# EAGLE design Glucose_Meter_Rev2 (EAGLE 7.6.0)
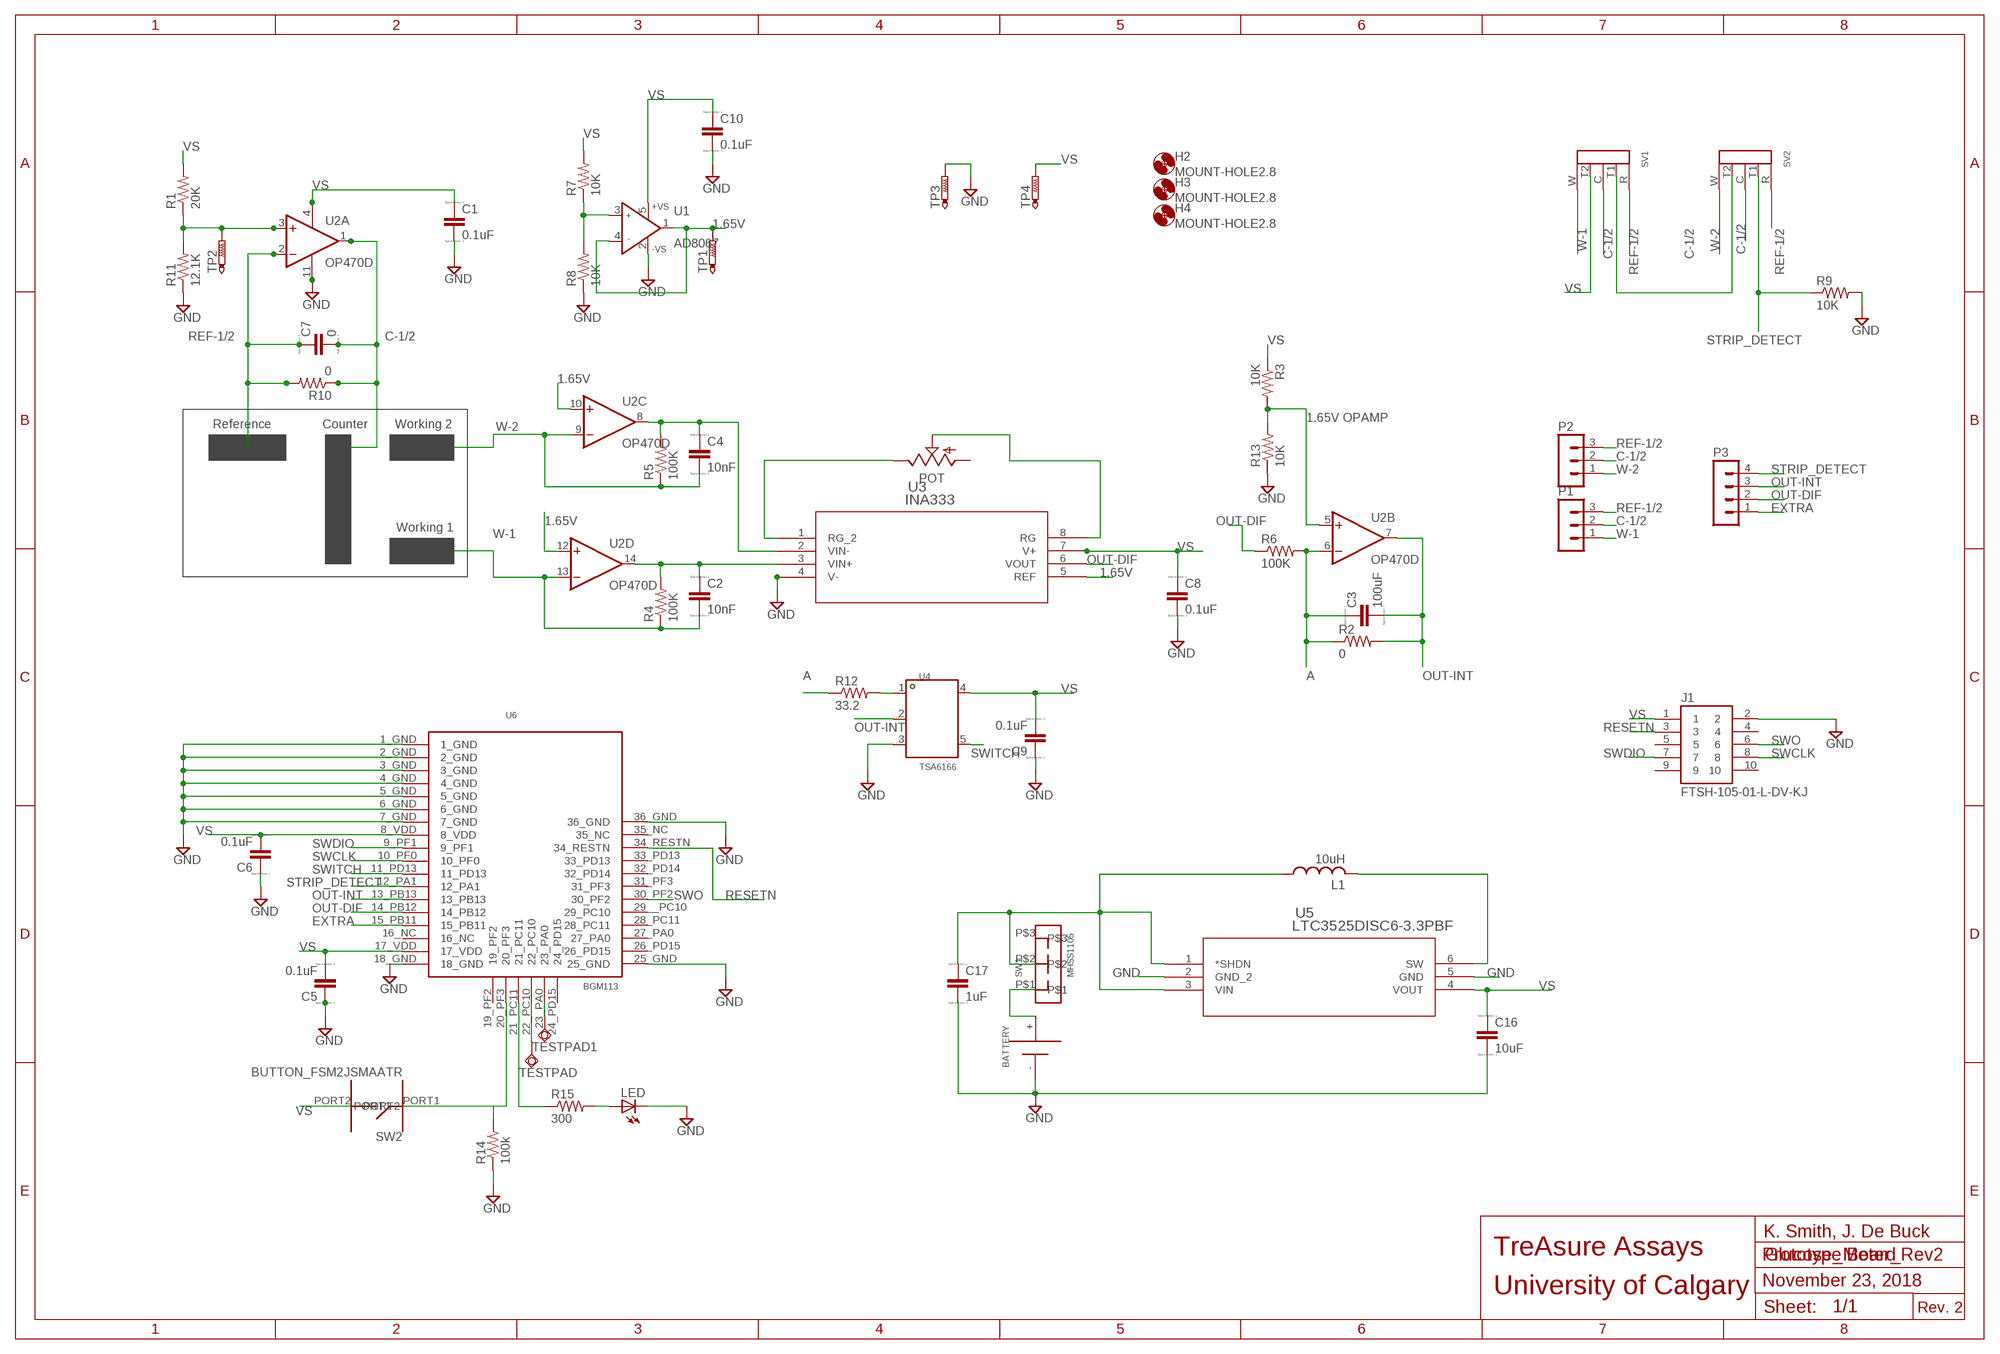
[diagram p0: schematic, sheet 1]

## Parts
BATTERY  SMTU2032  [SMTU2032]
C1  0.1uF  C  [C0805]
C2  10nF  C  [C0805]
C3  100uF  CC1210  [C1210]
C4  10nF  C  [C0805]
C5  0.1uF  C  [C0805]
C6  0.1uF  C  [C0805]
C7  0  C  [C0805]
C8  0.1uF  C  [C0805]
C9  0.1uF  C  [C0805]
C10  0.1uF  C  [C0805]
C16  10uF  C  [C0805]
C17  1uF  C  [C0805]
H2  MOUNT-HOLE2.8  [2,8]
H3  MOUNT-HOLE2.8  [2,8]
H4  MOUNT-HOLE2.8  [2,8]
J1  FTSH-105-01-L-DV-KJ  [SAMTEC_FTSH-105-01-L-DV-K]
L1  10uH  L-USL3225M  [L3225M]
LED  LED3MM  [LED3MM]
P1  MA03-1  [MA03-1]
P2  MA03-1  [MA03-1]
P3  MA04-1  [MA04-1]
POT  TRIM_US-RJ9W  [RJ9W]
R1  20K  R-US_R0805  [R0805]
R2  0  R-US_R0805  [R0805]
R3  10K  R-US_R0805  [R0805]
R4  100K  R-US_R0805  [R0805]
R5  100K  R-US_R0805  [R0805]
R6  100K  R-US_R0805  [R0805]
R7  10K  R-US_R0805  [R0805]
R8  10K  R-US_R0805  [R0805]
R9  10K  R-US_R0805  [R0805]
R10  0  R-US_R0805  [R0805]
R11  12.1K  R-US_R0805  [R0805]
R12  33.2  R-US_R0805  [R0805]
R13  10K  R-US_R0805  [R0805]
R14  100k  R-US_R0805  [R0805]
R15  300  R-US_R0805  [R0805]
SV1  SW-JS-05  [SW-JS-05]
SV2  SW-JS-05  [SW-JS-05]
SW1  MHSS1105  [MHSS1105]
SW2  BUTTON_FSM2JSMAATR  [BUTTON_FSM2JSMAATR]
TESTPAD  TPSQTP06R  [TP06R]
TESTPAD1  TPSQTP06R  [TP06R]
TP1  PTR1PAD1-13  [P1-13]
TP2  PTR1PAD1-13  [P1-13]
TP3  PTR1PAD1-13  [P1-13]
TP4  PTR1PAD1-13  [P1-13]
U1  AD8067  [SOT23-5]
U2  OP470D  [SO14]
U3  INA333  INA333_DGK_8  [DGK8]
U4  TSA6166  [SOT23-5]
U5  LTC3525DISC6-3.3PBF  [SC70-SC6]
U6  BGM113  [BGM113]

## Nets
1.65V: TP1.TP U1.1(OUT) U1.4(IN-) U2.10(C:+IN) U2.12(D:+IN) U3.5(REF)
3V_BATTERY1: C17.1 L1.1 SW1.P$2 U5.1(*SHDN) U5.3(VIN)
A: C3.1 R2.1 R6.2 R12.1 U2.6(B:-IN)
C-1/2: C7.2 P1.2 P2.2 R10.1 SV1.C SV2.C U2.1(A:OUT)
EXTRA: P3.1 U6.15_PB11
GND: BATTERY.- C1.2 C5.1 C6.1 C8.2 C9.1 C10.2 C16.2 C17.2 J1.2 LED.K(C) R8.1 R9.2 R11.1 R13.1 R14.1 TP3.TP U1.2(-VS) U2.11(P:V-) U3.4(V-) U4.3(GND) U5.2(GND_2) U5.5(GND) U6.1_GND U6.2_GND U6.3_GND U6.4_GND U6.5_GND U6.6_GND U6.7_GND U6.18_GND U6.25_GND U6.36_GND
N$1: R12.2 U4.1(A)
N$2: R1.1 R11.2 TP2.TP U2.3(A:+IN)
N$3: BATTERY.+ SW1.P$1
N$4: L1.2 U5.6(SW)
N$5: C4.1 R5.2 U2.8(C:OUT) U3.2(VIN-)
N$6: R14.2 SW2.PORT1 U6.20_PF3
N$7: POT.E U3.1(RG_2)
N$8: POT.S U3.8(RG)
N$9: LED.A R15.2
N$10: R15.1 U6.21_PC11
N$12: R7.1 R8.2 U1.3(IN+)
N$15: SV1.T1 SV2.T2
N$17: R3.2 R13.2 U2.5(B:+IN)
N$18: C2.1 R4.2 U2.14(D:OUT) U3.3(VIN+)
N$21: TESTPAD.TP U6.22_PC10
N$22: TESTPAD1.TP U6.23_PA0
OUT-DIF: P3.2 R6.1 U3.6(VOUT) U6.14_PB12
OUT-INT: C3.2 P3.3 R2.2 U2.7(B:OUT) U4.2(B) U6.13_PB13
REF-1/2: C7.1 P1.3 P2.3 R10.2 SV1.R SV2.R U2.2(A:-IN)
RESETN: J1.3 U6.34_RESTN
STRIP_DETECT: P3.4 R9.1 SV2.T1 U6.12_PA1
SWCLK: J1.8 U6.10_PF0
SWDIO: J1.7 U6.9_PF1
SWITCH: U4.5(ON/OFF) U6.11_PD13
SWO: J1.6 U6.30_PF2
VS: C1.1 C5.2 C6.2 C8.1 C9.2 C10.1 C16.1 J1.1 R1.2 R3.1 R7.2 SV1.T2 SW2.PORT2 TP4.TP U1.5(+VS) U2.4(P:V+) U3.7(V+) U4.4(VS) U5.4(VOUT) U6.8_VDD U6.17_VDD
W-1: C2.2 P1.1 R4.1 SV1.W U2.13(D:-IN)
W-2: C4.2 P2.1 R5.1 SV2.W U2.9(C:-IN)
Unconnected: J1.4 J1.5 J1.9 J1.10 POT.A SW1.P$3 U6.16_NC U6.19_PF2 U6.24_PD15 U6.26_PD15 U6.27_PA0 U6.28_PC11 U6.29__PC10(29_PC10) U6.31_PF3 U6.32_PD14 U6.33_PD13 U6.35_NC

## Notes on the sheet
- 1.65V OPAMP
- Reference | Counter | Working 2
- Working 1
- K. Smith, J. De Buck
- TreAsure Assays | Prototype Board
- November 23, 2018
- University of Calgary
- Rev. 2

## Library data of the parts
BATTERY = Katrin's Footprint:SMTU2032: Renata SMTU2032. Coin Cell Battery Holders SFC MNT FOR CR2032
C1-C10 C16 C17 = eagle-ltspice:C: CAPACITOR, European symbol; SPICEMODEL: NONE; SPICEPREFIX: C
H2-H4 = holes:MOUNT-HOLE: MOUNTING HOLE with drill center marker
J1 = FTSH-105-01-L-DV-K:FTSH-105-01-L-DV-K: Conn Unshrouded Header HDR 10 POS 1.27mm Solder ST SMD Automotive Tube; AVAILABILITY: Unavailable; DESCRIPTION: Conn Unshrouded Header HDR 10 POS 1.27mm Solder ST SMD Automotive Tube; MF: Samtec Inc.; MP: FTSH-105-01-L-DV-K; PACKAGE: TSSOP-20 Texas Instruments; PRICE: None
L1 = rcl:L-US: INDUCTOR, American symbol
LED = led:LED: LED OSRAM: - CHIPLED LG R971, LG N971, LY N971, LG Q971, LY Q971, LO R971, LY R971 LH N974, LH R974 LS Q976, LO Q976, LY Q976 LO Q996 - Hyper CHIPLED LW Q18S LB Q993, LB Q99A, LB R99A - SideLED LS A670, LO A670, LY A670, LG A670, LP A670 LB A673, LV A673, LT A673, LW A673 LH A674 LY A675 LS A676, LA A676, LO A676, LY A676, LW A676 LS A679, LY A679, LG A679 - Hyper Micro SIDELED® LS Y876, LA Y876, LO Y876, LY Y876 LT Y87S - SmartLED LW L88C, LW L88S LB L89C, LB L89S, LG L890 LS L89K, LO L89K, LY L89K LS L896, LA L896, LO L896, LY L896 - TOPLED LS T670, LO T670, LY T670, LG T670, LP T670 LSG T670, LSP T670, LSY T670, LOP T670, LYG T670 LG T671, LOG T671, LSG T671 LB T673, LV T673, LT T673, LW T673 LH T674 LS T676, LA T676, LO T676, LY T676, LB T676, LH T676, LSB T676, LW T676 LB T67C, LV T67C, LT T67C, LS T67K, LO T67K, LY T67K, LW E67C LS E67B, LA E67B, LO E67B, LY E67B, LB E67C, LV E67C, LT E67C LW T67C LS T679, LY T679, LG T679 LS T770, LO T770, LY T770, LG T770, LP T770 LB T773, LV T773, LT T773, LW T773 LH T774 LS E675, LA E675, LY E675, LS T675 LS T776, LA T776, LO T776, LY T776, LB T776 LHGB T686 LT T68C, LB T68C - Hyper Mini TOPLED® LB M676 - Mini TOPLED Santana® LG M470 LS M47K, LO M47K, LY M47K Source: http://www.osram.convergy.de LUXEON: - LUMILED® LXK2-PW12-R00, LXK2-PW12-S00, LXK2-PW14-U00, LXK2-PW14-V00 LXK2-PM12-R00, LXK2-PM12-S00, LXK2-PM14-U00 LXK2-PE12-Q00, LXK2-PE12-R00, LXK2-PE12-S00, LXK2-PE14-T00, LXK2-PE14-U00 LXK2-PB12-K00, LXK2-PB12-L00, LXK2-PB12-M00, LXK2-PB14-N00, LXK2-PB14-P00, LXK2-PB14-Q00 LXK2-PR12-L00, LXK2-PR12-M00, LXK2-PR14-Q00, LXK2-PR14-R00 LXK2-PD12-Q00, LXK2-PD12-R00, LXK2-PD12-S00 LXK2-PH12-R00, LXK2-PH12-S00 LXK2-PL12-P00, LXK2-PL12-Q00, LXK2-PL12-R00 Source: www.luxeon.com KINGBRIGHT: KA-3528ASYC Source: www.kingbright.com
P1 P2 = con-lstb:MA03-1: PIN HEADER; OC_FARNELL: unknown; OC_NEWARK: unknown
P3 = con-lstb:MA04-1: PIN HEADER; OC_FARNELL: unknown; OC_NEWARK: unknown
POT = pot:TRIM_US-: POTENTIOMETER
R1-R15 = resistor:R-US_: RESISTOR, American symbol
SV1 SV2 = Katrin's Footprint:SW-JS-05: Footprint for SW-JS-05 connector for ONE TOUCH ULTRA glucose test strips
SW1 = Katrin's Footprint:MHSS1105
SW2 = Katrin's Footprint:BUTTON_FSM2JSMAATR
TESTPAD TESTPAD1 = testpad:TPSQ: Test pad
TP1-TP4 = testpad:PTR1: TEST PIN
U1 = analog-devices:AD8067: High Gain Bandwidth, Precision Fast FET(TM) Op Amp Source: http://www.analog.com/UploadedFiles/Data_Sheets/346131962AD8067_a.pdf; MF: ALTERA CORPORATION; MPN: AD8067ARTZ-REEL7; OC_FARNELL: 1464848; OC_NEWARK: 59K6326
U2 = linear:OP470: OP AMP
U3 = INA333:INA333_DGK_8; DATASHEETURL: http://www.ti.com/lit/gpn/INA333; FAMILY_NAME: SINGLE SUPPLY; GENERIC_PART_NUMBER: INA333; INDUSTRY_STD_PKG_TYPE: MSOP; MANUFACTURER: Texas Instruments; MANUFACTURER_PART_NUMBER: ina333_dgk_8; PACKAGE_DESIGNATOR: DGK; PIN_COUNT: 8; VENDOR: Texas Instruments
U4 = Katrin's Footprint:TSA6166
U5 = LTC3525D-3.3:LTC3525DISC6-3.3PBF; MANUFACTURER_PART_NUMBER: ltc3525disc6-3.3#pbf; VENDOR: Linear Technology
U6 = Katrin's Footprint:BGM113

## Board
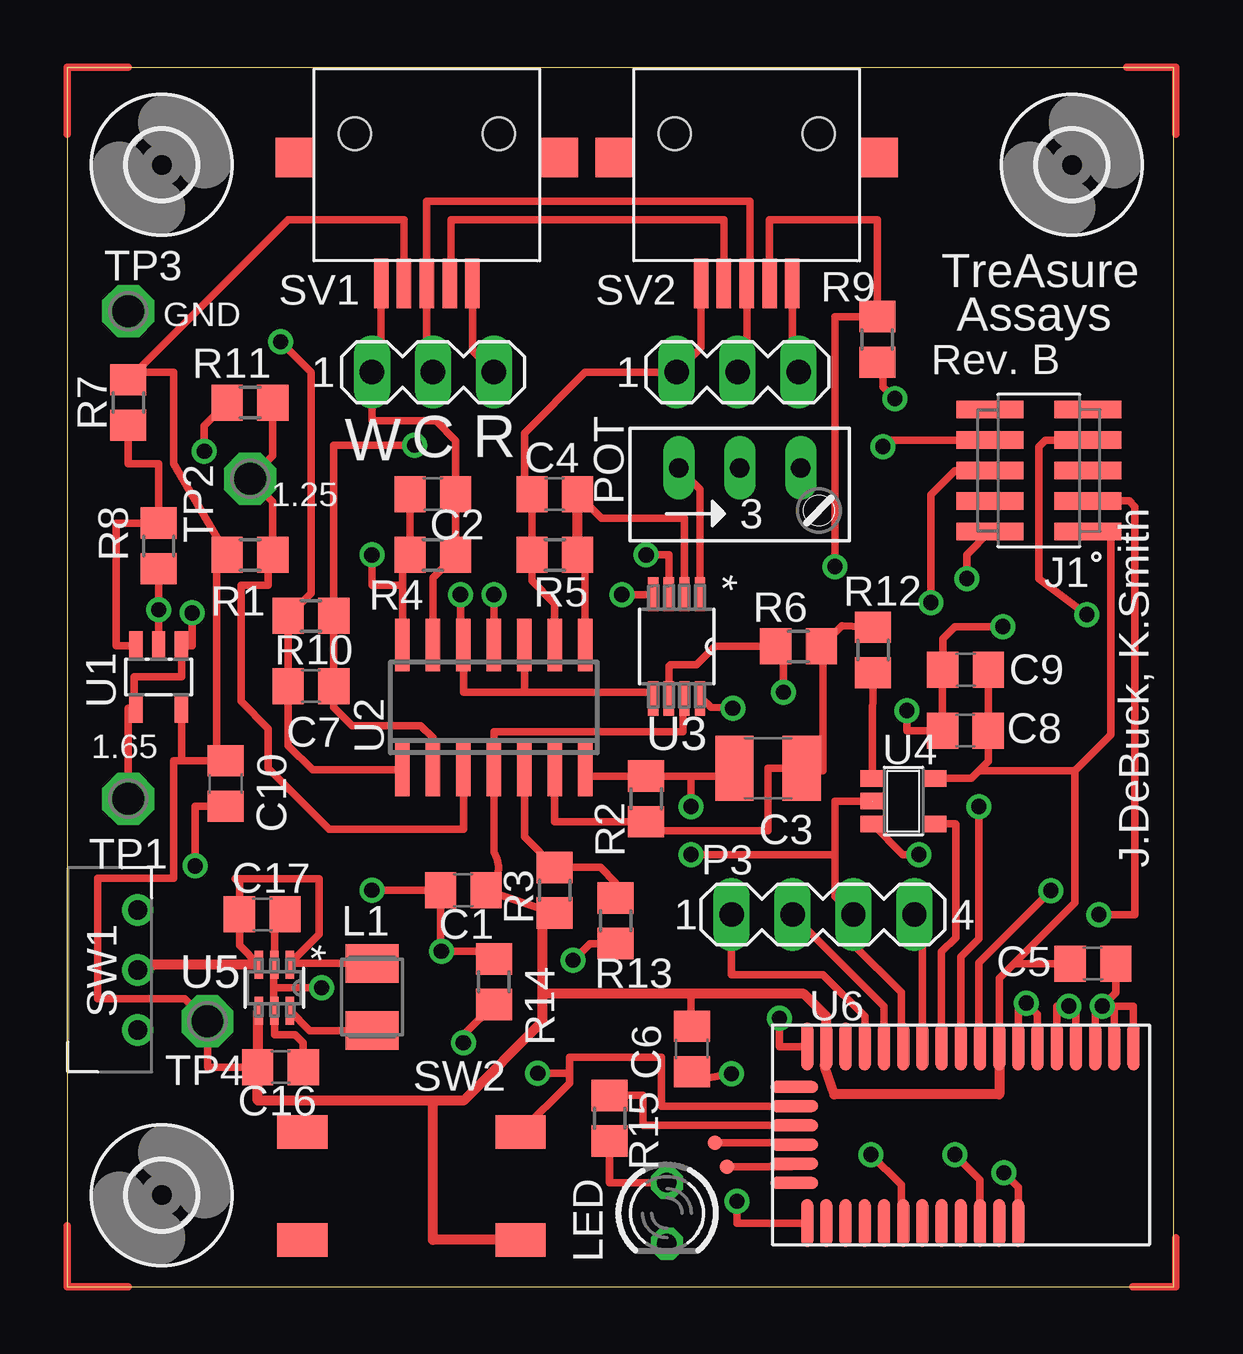
[diagram p1: board, top side]
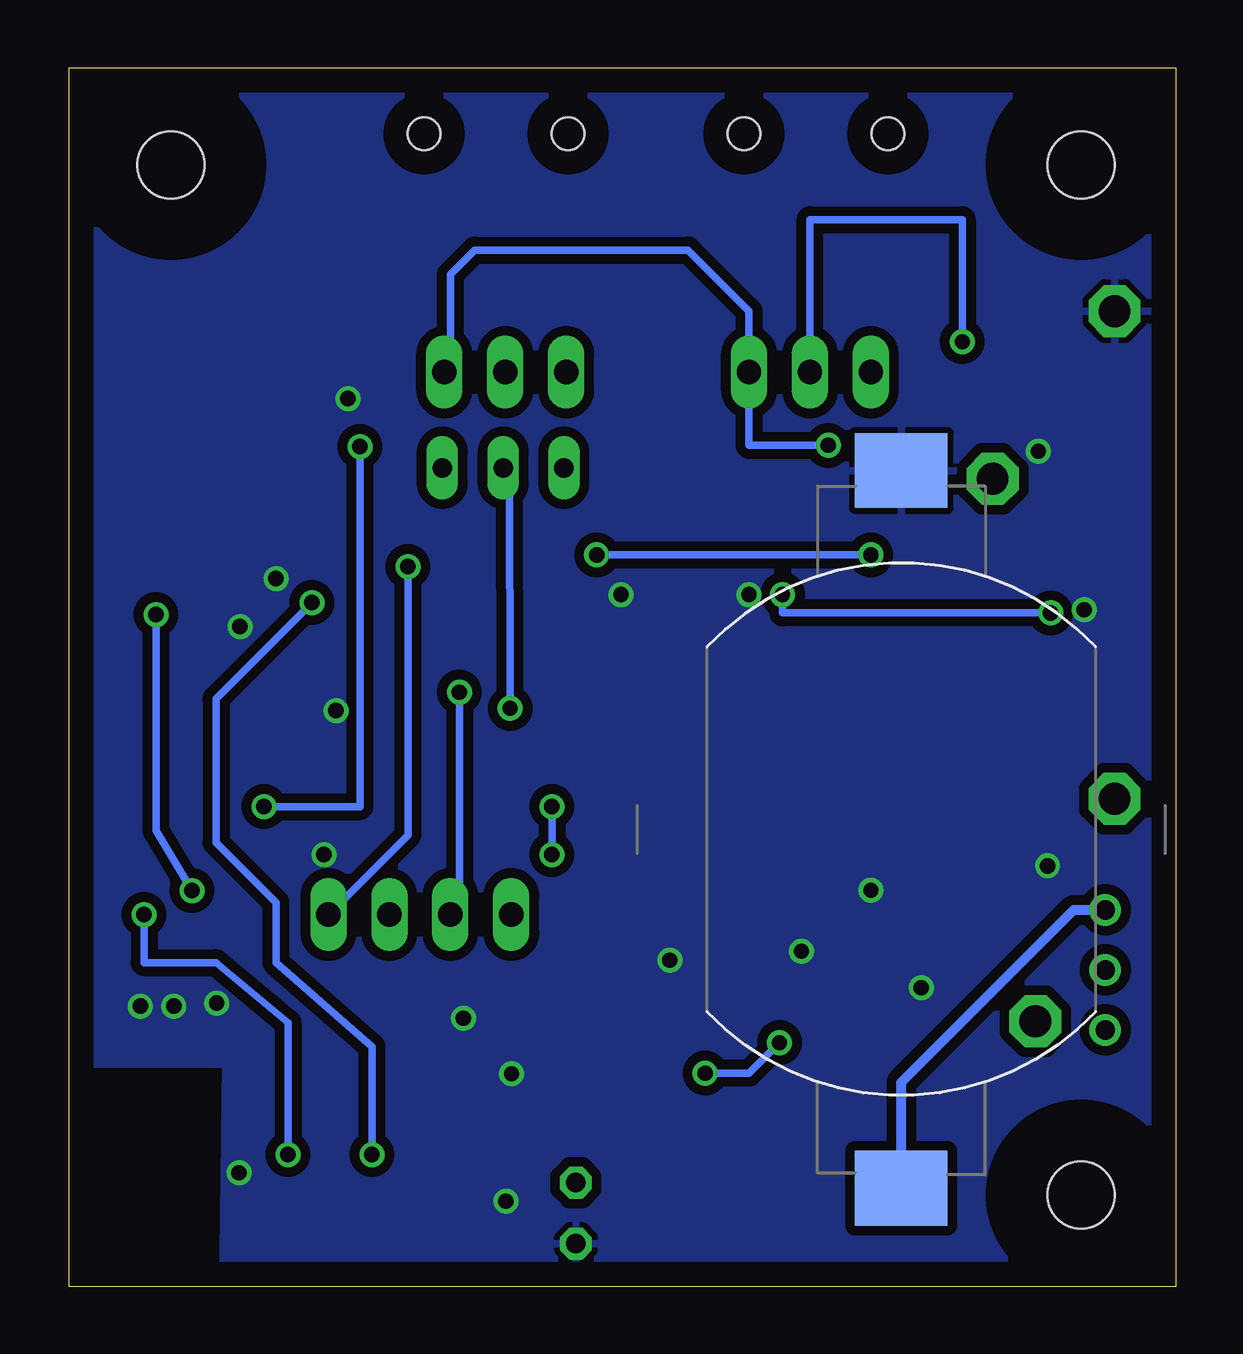
[diagram p2: board, bottom side, seen from below]

Size 46.12 x 50.79 mm. Coordinates in mm from the lower left corner, seen from the top.
Outline: 0,0 46.12,0 46.12,50.79 0,50.79 0,0
Copper layers (1*16): Top 0.035mm / dielectric 1.5mm / Bottom 0.035mm
Design rules "default": minimum track width 10mil, minimum drill 24mil, track to track 8mil, track to pad 8mil, pad to pad 8mil, via to via 8mil, smd to smd 8mil, copper to edge 40mil, drill to drill 8mil, minimum pad ring 10mil, minimum via ring 8mil, stop-mask expansion 4mil, vias tented up to drill 0mil, thermal gap 10mil

### Footprints (pad centres in the part's own frame; a part is rotated, then mirrored left to right if it is on the bottom)
SMTU2032 = smd 3.12 x 3.85: + -14.95,0; - 14.95,0
C0805 = smd 1.3 x 1.5: 1 -0.95,0; 2 0.95,0
C1210 = smd 1.6 x 2.7: 1 -1.4,0; 2 1.4,0
2,8 = hole 2.8: 0,0
SAMTEC_FTSH-105-01-L-DV-K = smd 0.74 x 2.79: 1 -2.54,-2.035; 2 -2.54,2.035; 3 -1.27,-2.035; 4 -1.27,2.035; 5 0,-2.035; 6 0,2.035; 7 1.27,-2.035; 8 1.27,2.035; 9 2.54,-2.035; 10 2.54,2.035
L3225M = smd 1.6 x 2.2: 1 -1.4,0; 2 1.4,0
LED3MM = drill 0.813 octagon: A -1.27,0; K 1.27,0
MA03-1 = drill 1.016 long: 1 -2.54,0; 2 0,0; 3 2.54,0
MA04-1 = drill 1.016 long: 1 -3.81,0; 2 -1.27,0; 3 1.27,0; 4 3.81,0
RJ9W = drill 0.813 long: A 2.54,0.635; E -2.54,0.635; S 0,0.635
R0805 = smd 1.3 x 1.5: 1 -0.95,0; 2 0.95,0
SW-JS-05 = smd 0.605 x 2.067: C 0,4.95; R -1.9,4.95; T1 -0.95,4.95; T2 0.95,4.95; W 1.9,4.95 | smd 1.62 x 1.65: P$6 -5.5,-0.3; P$7 5.5,-0.3 | hole 1.35: -3,-1.3; 3,-1.3
MHSS1105 = drill 0.8: P$1 -2.5,1.155; P$2 0,1.155; P$3 2.5,1.155
BUTTON_FSM2JSMAATR = smd 1.4 x 2.1: P$3 2.25,-4.05; P$4 -2.25,-4.05; PORT1 -2.25,5.05; PORT2 2.25,5.05
TP06R = smd 0.6 x 0.6: TP 0,0
P1-13 = drill 1.321 pad 2.159 octagon: TP 0,0
SOT23-5 = smd 0.55 x 1.2: 1 -0.95,-1.3; 2 0,-1.3; 3 0.95,-1.3; 4 0.95,1.3; 5 -0.95,1.3
SO14 = smd 0.6 x 2.2: 1 -3.81,-2.6; 2 -2.54,-2.6; 3 -1.27,-2.6; 4 0,-2.6; 5 1.27,-2.6; 6 2.54,-2.6; 7 3.81,-2.6; 8 3.81,2.6; 9 2.54,2.6; 10 1.27,2.6; 11 0,2.6; 12 -1.27,2.6; 13 -2.54,2.6; 14 -3.81,2.6
DGK8 = smd 1.422 x 0.432: 1 -2.172,0.975; 2 -2.172,0.325; 3 -2.172,-0.325; 4 -2.172,-0.975; 5 2.172,-0.975; 6 2.172,-0.325; 7 2.172,0.325; 8 2.172,0.975
SOT23-5' = smd 0.69 x 0.99: 1 -0.95,-1.29; 2 0,-1.29; 3 0.95,-1.29; 4 -0.95,1.3; 5 0.95,1.3
SC70-SC6 = smd 1.168 x 0.356: 1 -0.965,0.65; 2 -0.965,0; 3 -0.965,-0.65; 4 0.965,-0.65; 5 0.965,0; 6 0.965,0.65
BGM113 = smd 2 x 0.5: 1_GND 0.9,15.05; 2_GND 0.9,14.25; 3_GND 0.9,13.45; 4_GND 0.9,12.65; 5_GND 0.9,11.85; 6_GND 0.9,11.05; 7_GND 0.9,10.25; 8_VDD 0.9,9.45; 9_PF1 0.9,8.65; 10_PF0 0.9,7.85; 11_PD13 0.9,7.05; 12_PA1 0.9,6.25; 13_PB13 0.9,5.45; 14_PB12 0.9,4.65; 15_PB11 0.9,3.85; 16_NC 0.9,3.05; 17_VDD 0.9,2.25; 18_GND 0.9,1.45; 25_GND 8.25,1.45; 26_PD15 8.25,2.25; 27_PA0 8.25,3.05; 28_PC11 8.25,3.85; 29__PC10 8.25,4.65; 30_PF2 8.25,5.45; 31_PF3 8.25,6.25; 32_PD14 8.25,7.05; 33_PD13 8.25,7.85; 34_RESTN 8.25,8.65; 35_NC 8.25,9.45; 36_GND 8.25,10.25 | smd 0.5 x 2: 19_PF2 2.575,0.9; 20_PF3 3.375,0.9; 21_PC11 4.175,0.9; 22_PC10 4.975,0.9; 23_PA0 5.775,0.9; 24_PD15 6.575,0.9

### Placement (x,y rotation side)
BATTERY  11.43,19.05 90 bottom
C1  16.51,16.51 180 top
C2  15.24,33.02 0 top
C3  29.21,21.59 180 top
C4  20.32,33.02 180 top
C5  42.75,13.46 180 top
C6  26.03,9.9 90 top
C7  10.16,25.02 180 top
C8  37.43,23.16 180 top
C9  37.44,25.7 0 top
C10  6.6,20.95 270 top
C16  8.89,9.14 0 top
C17  8.13,15.5 0 top
H2  3.94,3.81 0 top
H3  41.88,46.74 0 top
H4  3.94,46.74 0 top
J1  40.5,34 90 top
L1  12.7,12.06 270 top
LED  25,3.06 270 top
P1  15.24,38.1 0 top
P2  27.94,38.1 0 top
P3  31.5,15.5 0 top
POT  28.03,33.48 0 top
R1  7.62,30.48 180 top
R2  24.13,20.32 90 top
R3  20.32,16.51 90 top
R4  15.24,30.48 180 top
R5  20.32,30.48 0 top
R6  30.48,26.67 0 top
R7  2.54,36.83 90 top
R8  3.81,30.86 90 top
R9  33.77,39.46 270 top
R10  10.16,27.94 0 top
R11  7.62,36.83 0 top
R12  33.58,26.52 270 top
R13  22.86,15.24 90 top
R14  17.78,12.7 270 top
R15  22.61,7.01 270 top
SV1  14.99,46.74 180 top
SV2  28.32,46.74 180 top
SW1  1.78,13.19 270 top
SW2  13.84,4.19 270 top
TESTPAD  27,6 0 top
TESTPAD1  27.5,5 0 top
TP1  2.54,20.32 0 top
TP2  7.62,33.66 0 top
TP3  2.54,40.64 0 top
TP4  5.84,11.05 0 top
U1  3.81,25.4 180 top
U2  17.78,24.13 0 top
U3  25.4,26.67 270 top
U4  TSA6166  [SOT23-5']  34.85,20.23 270 top
U5  8.64,12.45 270 top
U6  29.39,10.89 270 top

### Tracks (layer width: path | path; a pad name or v marks a point on that pad's centre or on a via)
1.65V  (via drill 0.64)
  Top 0.305: 19.05,24.77 16.51,24.77 U2.12 16.38,26.73 v16.38,28.83 | 19.05,24.77 U2.10 | 2.79,24.1 2.79,25.4 4.76,25.4 U1.1 5.21,26.7 v5.21,28.07 | TP1.TP 2.54,24.1 U1.4 | U3.5 24.43,24.77 19.05,24.77
  Top 0.406: 2.79,24.1 U1.4
  Bottom 0.305: v5.21,28.07 16.38,28.07 v16.38,28.83
3V_BATTERY1
  Top 0.305: U5.3 7.18,14.22 C17.1 7.18,16.82 7,17 10.5,17 10.5,14.68 9.29,13.46 | L1.1 9.29,13.46 | 9.29,13.46 U5.1
  Top 0.406: SW1.P$2 3.64,13.41 U5.3
A
  Top 0.305: U2.6 20.32,19.37 R2.1 | R2.1 24.13,18.92 | C3.1 29.21,21.59 29.21,18.99 24.13,18.99 R2.1 | 30.61,21.53 C3.1 | R12.1 32.29,27.53 R6.2 31.5,26.67 31.5,21.5 30.61,21.5 C3.1
C-1/2  (via drill 0.64)
  Top 0.305: U2.1 10.22,21.53 9.21,22.54 C7.2 R10.1 10.16,28.89 10.16,38.1 v8.89,39.37 | P1.2 14.99,38.35 SV1.C 14.99,45.21 28.45,45.21 28.45,41.66 SV2.C 28.32,38.1 P2.2
  Bottom 0.305: P1.2 15.24,44.45 8.89,44.45 v8.89,39.37
EXTRA
  Top 0.305: P3.1 27.69,13 31.5,13 33.24,11.26 U6.15_PB11
GND  (via drill 0.64)
  Top 0.305: R8.1 v3.81,28.19 U1.2 | U2.11 v17.78,28.83 | 40.35,10.08 U6.6_GND 40.44,11.34 v39.97,11.81 39.64,11.81 U6.7_GND | U6.5_GND 41.24,11.68 v41.75,11.68 42.04,11.68 U6.4_GND 42.01,10.03 | U6.3_GND 42.84,11.68 v43.15,11.68 | U6.2_GND 43.64,11.68 | 43.64,11.68 v43.15,11.68 | U6.1_GND 44.44,11.68 43.64,11.68 | U3.4 v23.11,28.83 | U6.25_GND 27.92,2.64 v27.92,3.56 | U6.18_GND 29.69,9.99 v29.69,11.18 | U6.36_GND 39.64,4.14 v39.04,4.74 | C10.2 5.33,20 v5.33,17.53 | R11.1 5.71,35.88 v5.71,34.8 | v12.7,16.51 C1.2 15.56,13.97 v15.6,13.97 17.46,13.97 R14.1 | R13.1 21.78,14.29 v21.08,13.59 | 10.09,8.89 C16.2 9.84,10.16 9.5,10.5 8.64,10.5 U5.5 8.6,11.52 8.6,12.45 | C17.2 8.64,15.06 U5.2 8.6,13.38 8.6,12.45 | 8.6,12.45 v10.6,12.45 | v27.68,8.86 25.95,8.55 C6.1 | v39,27.5 37,27.5 36.5,27 C9.1 | C9.1 | J1.2 37.5,30.5 v37.5,29.5 | C9.1 C8.2 35,23.16 v35,24 | U4.3 34.84,18 v35.5,18 | R9.2 34,38.51 34,37.5 v34.5,37 | C5.1 43.7,12.24 v43.15,11.68
  Bottom 0.305: 43.15,11.81 43.4,11.81
  pour Bottom (isolate 0.406): 0,50.8 0,0 39.72,-0.13 39.59,9.27 46.07,9.27 46.2,50.8
N$1
  Top 0.305: R12.2 33.56,22.93 U4.1
N$2
  Top 0.305: U2.3 16.51,19.05 10.92,19.05 8.38,21.59 8.38,23.24 7.24,24.38 7.24,29.21 8.38,29.21 8.38,30.48 R1.1 8.57,32.7 TP2.TP 8.57,34.6 R11.2
N$3
  Bottom 0.406: BATTERY.+ 11.43,8.51 4.25,15.69 SW1.P$1
N$4
  Top 0.305: U5.6 10.1,10.66 L1.2
N$5
  Top 0.305: U2.8 21.59,30.48 | U3.2 25.73,32.02 22.27,32.02 C4.1
  Top 0.406: 21.59,30.48 R5.2 C4.1
N$6  (via drill 0.64)
  Top 0.305: U6.20_PF3 24.77,7.52 24.77,9.55 20.93,9.55 20.93,8.89 | 20.93,8.89 20.93,8.47 SW2.PORT1 | R14.2 16.51,10.48 v16.51,10.16 | v19.61,8.89 20.93,8.89
  Bottom 0.305: v16.51,10.16 17.78,8.89 v19.61,8.89
N$7
  Top 0.305: POT.E 26.38,33.23 U3.1
N$8  (via drill 0.64)
  Top 0.305: U3.8 26.42,24.54 26.82,24.13 v27.74,24.09
  Bottom 0.305: v27.74,24.09 27.76,34.02 arc-90 POT.S
N$9
  Top 0.305: LED.A 22.61,4.33 R15.2
N$10
  Top 0.305: R15.1 24,7.96 24,6.72 U6.21_PC11
N$12
  Top 0.305: U1.3 2.03,26.7 2.03,31.81 R8.2 3.81,34.29 2.54,34.29 R7.1
N$14
  Top 0.305: 0,2.54 0,0 2.54,0
N$15
  Top 0.305: SV2.T2 27.37,44.45 16,44.45 16,41.79
  Top 0.406: 16,41.79 SV1.T1
N$16
  Top 0.305: 46.2,2.03 46.2,0 44.42,0
N$17
  Top 0.305: U2.5 19.05,18.73 R3.2 22.23,17.46 22.86,16.83 R13.2
N$18  (via drill 0.64)
  Top 0.305: U2.14 13.97,29.21 | 13.97,29.21 13.97,30.16 | R4.2 C2.1 | U3.3 25.07,30.48 v24.13,30.48 | v12.7,30.48 12.7,29.21 13.97,29.21
  Top 0.406: 13.97,30.16 R4.2
  Bottom 0.305: v24.13,30.48 v12.7,30.48
N$19
  Top 0.305: 44.16,50.8 46.2,50.8 46.2,48.01
N$20
  Top 0.305: 0,48.01 0,50.8 2.54,50.8
N$21
  Top 0.305: U6.22_PC10 30.21,6 TESTPAD.TP
N$22
  Top 0.305: U6.23_PA0 30.18,5 TESTPAD1.TP
OUT-DIF  (via drill 0.64)
  Top 0.305: U3.6 25.07,25.84 25.15,25.91 26.23,25.91 26.99,26.67 R6.1 29.85,26.35 v29.85,24.77 | P3.2 34.04,11.69 U6.14_PB12
  Bottom 0.305: 30.23,15.64 P3.2 arc-90 29.85,15.88 v29.85,24.77
OUT-INT  (via drill 0.64)
  Top 0.305: U2.7 21.59,21.27 R2.2 | R2.2 24.13,21.72 | U4.2 32,20.23 32,18 | U6.13_PB13 34.76,10.07 34.76,12.26 32.77,14.25 P3.3 32,16.27 32,18 | R2.2 26,21.27 | 26,21.27 v26,20 | v26,18 32,18 | 26,21.27 27.81,21.27 C3.2
  Bottom 0.305: v26,20 v26,18
REF-1/2  (via drill 0.64)
  Top 0.305: U2.2 15.24,22.86 14.73,23.37 11.87,23.37 11.11,24.13 C7.1 R10.2 11.11,35.05 v14.48,35.05 | P1.3 16.89,38.99 SV1.R | SV2.R 30.22,38.36 P2.3
  Bottom 0.305: v14.48,35.05 17.78,35.05 P1.3 17.78,40.64 20.32,43.18 29.21,43.18 30.22,42.17 30.22,38.36 arc90 P2.3
RESETN  (via drill 0.64)
  Top 0.305: v37,5.5 38.04,4.46 U6.34_RESTN | v43,15.5 44.5,15.5 44.5,32.5 44.27,32.73 J1.3
  Bottom 0.305: v43,15.5 43,13.5 40,13.5 37,11 v37,5.5
STRIP_DETECT  (via drill 0.64)
  Top 0.305: SV2.T1 29.27,44.45 33.77,44.45 R9.1 32,40.41 v32,30 | P3.4 35.64,15.17 U6.12_PA1
  Bottom 0.305: v32,30 32,18.81 P3.4
SWCLK  (via drill 0.64)
  Top 0.305: U6.10_PF0 37.24,13.74 38,14.5 v38,20 | J1.8 34.27,35.27 v34,35
  Bottom 0.305: v38,20 34,20 v34,35
SWDIO  (via drill 0.64)
  Top 0.305: U6.9_PF1 38,10.03 38,13.5 v41,16.5 | v42.5,28 40.5,29.5 40.5,35 40.77,35.27 J1.7
  Top 0.406: 38.07,9.99 U6.9_PF1
  Bottom 0.305: v41,16.5 42.5,19 v42.5,28
SWITCH
  Top 0.305: U6.11_PD13 36.44,13.94 37.04,14.54 37.04,19.26 37.02,19.27 U4.5
SWO  (via drill 0.64)
  Top 0.305: J1.6 37,34 36,33 v36,28.5 | U6.30_PF2 34.82,2.64 34.76,2.7 34.76,4.24 v33.5,5.5
  Bottom 0.305: v36,28.5 40,24.5 40,18.5 37.5,16 37.5,13.5 33.5,10 v33.5,5.5
VS
  Top 0.305: 2.54,38.1 4.45,38.1 4.45,34.29 R1.2 6.22,30.03 6.22,22.29 C10.1 4.76,21.91 | 4.76,22.86 U1.5 4.76,21.91 | R3.1 C1.1 arc90 17.78,18.1 U2.4 17.78,23.11 25.65,23.11 25.65,24.5 U3.7 | U5.4 7.94,11.44 | C16.1 5.84,9.14 TP4.TP 4.89,12 1.27,12 1.27,17.01 4.45,17.01 4.45,21.91 4.76,21.91 | SV1.T2 14.04,44.45 9.21,44.45 R7.2 | C6.2 26,11.32 26,12.19 | 38.38,22.5 C8.1 38.6,22.94 | 38.38,22.5 38.38,21.88 38,21.5 | C9.2 38.39,22.51 38.38,22.5 | J1.1 43.46,31.46 43.5,31.5 43.5,23 42,21.5 | U6.8_VDD 38.84,12.84 39.5,13.5 | 39.5,13.5 42,16 42,21.5 | C5.2 39.54,13.46 39.5,13.5 | 42,21.5 38,21.5 | 38,21.5 37.67,21.18 U4.4
  Top 0.406: 2.54,38.1 R7.2 | 7.94,11.44 C16.1 7.94,7.75 15.24,7.75 | 19.81,12.19 26,12.19 30.7,12.19 31.64,11.25 U6.17_VDD 31.59,9.14 31.97,8 38.84,8 U6.8_VDD | 15.24,7.75 16.51,7.75 19.81,11.05 19.81,12.19 | 19.81,12.19 19.81,15.56 R3.1 | SW2.PORT2 15.24,1.94 15.24,7.75
W-1
  Top 0.305: U2.13 15.24,29.53 R4.1 C2.2 16.19,35.24 15.37,36.07 12.7,36.07 P1.1 13.09,38.49 SV1.W
W-2
  Top 0.305: U2.9 20.32,28.45 19.37,29.4 R5.1 C4.2 19.05,33.34 19.05,35.56 21.59,38.1 P2.1 26.42,39.12 SV2.W

### Text on the board
tPlace: TreAsure | Assays | GND | Rev. B | C | R | W | 1.25 | J.DeBuck, K.Smith | 1.65 | U3 | U5